# Altium schematic sheet DS_zk.SchDoc
size A3
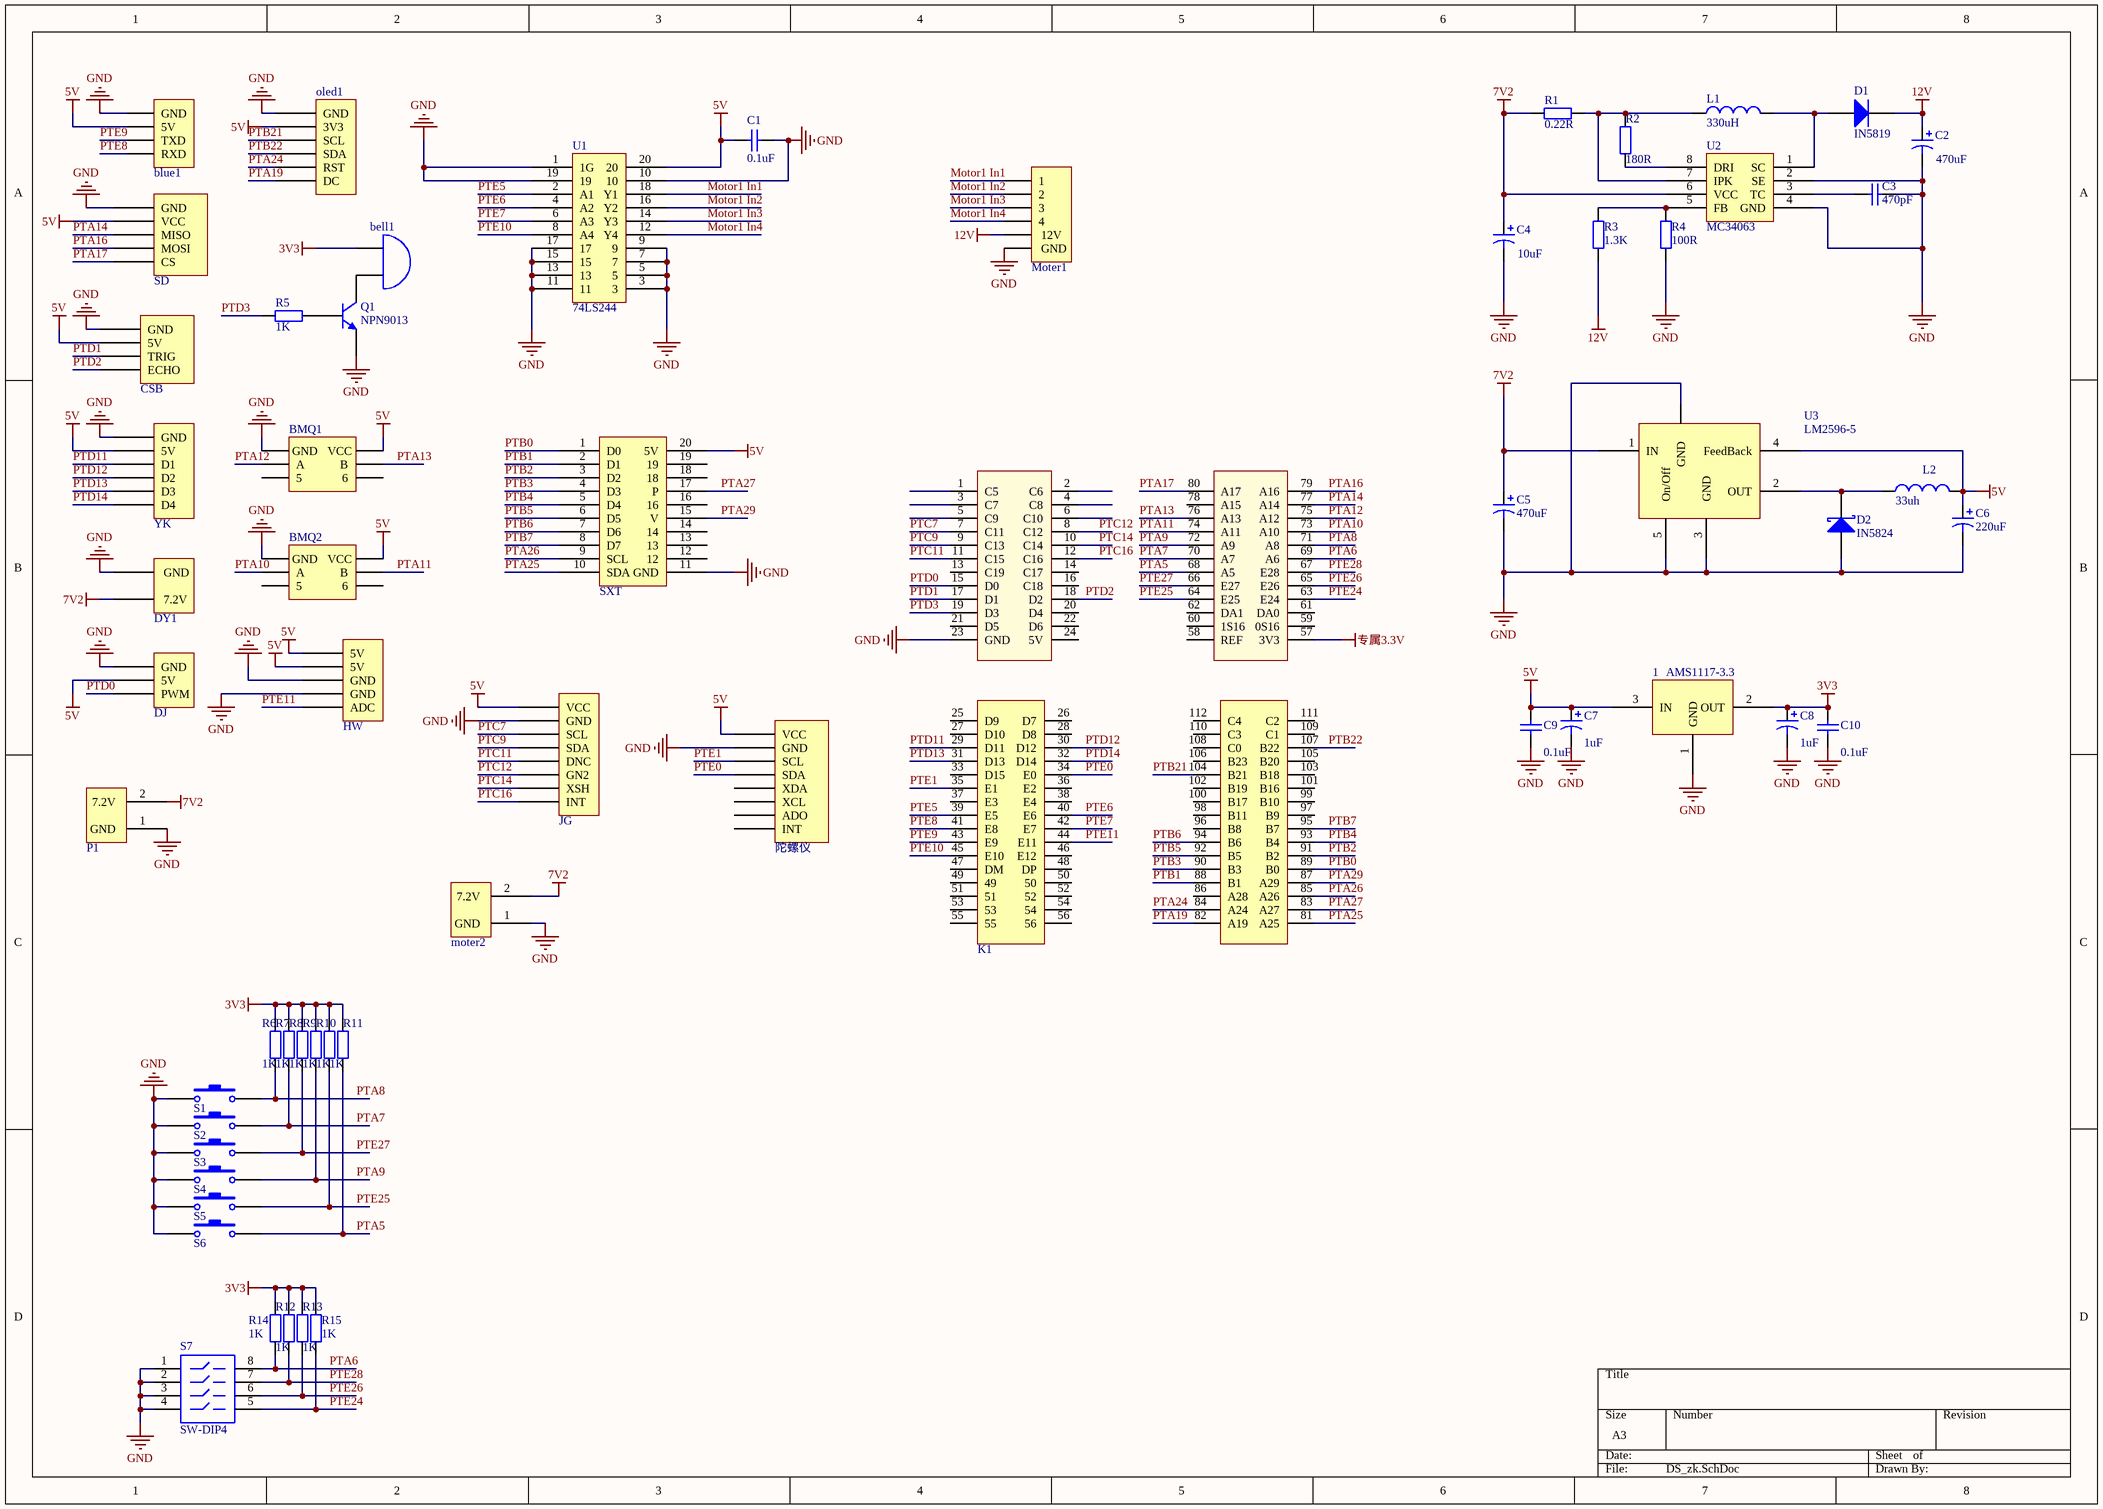
[diagram p0: DS_zk.SchDoc]

## Parts
1  AMS1117-3.3  [lm1117-5v]
*1  SD  [HDR1X5 - duplicate]
*2  CSB  [HDR1X4]
*3  YK  [HDR1X6]
*4  SXT  [摄像头]
*5  HW  [HDR1X5]
*6  DJ  [HDR1X3]
*7  JG  [HDR1X8]
*8  陀螺仪  [HDR1X8]
bell1  Bell  [bezzer]  (value not drawn)
blue1  blueteeth2  [HDR1X4]  (value not drawn)
BMQ1  encode_1  [HDR2X3]  (value not drawn)
BMQ2  encode_2  [HDR2X3]  (value not drawn)
C1  0.1uF  [0603]
C2  470uF  [470UF]
C3  470pF  [0805]
C4  10uF  [0805]
C5  value 470uF  [470uf]  (hidden comment: Cap Pol1)
C6  value 220uF  [220uf]  (hidden comment: Cap Pol1)
C7  value 1uF  [0805]  (hidden comment: Cap Pol1)
C8  value 1uF  [0805]  (hidden comment: Cap Pol1)
C9  value 0.1uF  [0805]  (hidden comment: Cap)
C10  value 0.1uF  [0805]  (hidden comment: Cap)
D1  IN5819  [0805LED]
D2  IN5824  [1N5824]
DY1  H1  [HDR1X2]  (value not drawn)
K1  K60  [DS_K60]  (value not drawn)
L1  330uH  [电感8*8]
L2  value 33uh  [电感8*8]  (hidden comment: Inductor)
Moter1  Motor  [HDR1X6]  (value not drawn)
moter2  H1  [KF301-2P]  (value not drawn)
oled1  OLED  [HDR1X6]  (value not drawn)
P1  H1  [KF301-2P]  (value not drawn)
Q1  NPN9013  [npn9013]
R1  0.22R  [0805]
R2  180R  [0805]
R3  1.3K  [0805]
R4  100R  [0805]
R5  value 1K  [0805]  (hidden comment: Res2)
R6  value 1K  [0805]  (hidden comment: Res2)
R7  value 1K  [0805]  (hidden comment: Res2)
R8  value 1K  [0805]  (hidden comment: Res2)
R9  value 1K  [0805]  (hidden comment: Res2)
R10  value 1K  [0805]  (hidden comment: Res2)
R11  value 1K  [0805]  (hidden comment: Res2)
R12  value 1K  [0805]  (hidden comment: Res2)
R13  value 1K  [0805]  (hidden comment: Res2)
R14  value 1K  [0805]  (hidden comment: Res2)
R15  value 1K  [0805]  (hidden comment: Res2)
S1  SW-PB  [BUTTON]  (value not drawn)
S2  SW-PB  [BUTTON]  (value not drawn)
S3  SW-PB  [BUTTON]  (value not drawn)
S4  SW-PB  [BUTTON]  (value not drawn)
S5  SW-PB  [BUTTON]  (value not drawn)
S6  SW-PB  [BUTTON]  (value not drawn)
S7  SW-DIP4  [BMKG]
U1  74LS244  [74ls244DA]
U2  MC34063  [MC34063]
U3  LM2596-5  [LM2596]

## Nets
3V3: 1.2(OUT) bell1.1(A) C8.1 C10.2 R6.2 R7.2 R8.2 R9.2 R10.2 R11.2 R12.2 R13.2 R14.2 R15.2
5V: 1.3(IN) *1.2(VCC) *2.2(5V) *3.2(5V) *4.20(5V) *5.1(5V) *5.2(5V) *6.2(5V) *7.1(VCC) *8.1(VCC) blue1.2(5V) BMQ1.2(VCC) BMQ2.2(VCC) C1.2 C6.1 C7.1 C9.2 L2.2 oled1.2(3V3) U1.20 U3.4(FeedBack)
7V2: C4.1 C5.1 DY1.2(7.2V) moter2.2(7.2V) P1.2(7.2V) R1.2 U2.6(VCC) U3.1(IN)
12V: C2.1 D1.2(K) Moter1.5(12V) R3.2
GND: 1.1(GND) *1.1(GND) *2.1(GND) *3.1(GND) *4.11(GND) *5.3(GND) *5.4(GND) *6.1(GND) *7.2(GND) *8.2(GND) blue1.1(GND) BMQ1.1(GND) BMQ2.1(GND) C1.1 C2.2 C3.2 C4.2 C5.2 C6.2 C7.2 C8.2 C9.1 C10.1 D2.2(K) DY1.1(GND) K1.23(GND) Moter1.6(GND) moter2.1(GND) oled1.1(GND) P1.1(GND) Q1.1(E) R4.2 S1.1 S2.1 S3.1 S4.1 S5.1 S6.1 S7.1 S7.2 S7.3 S7.4 U1.1(1G) U1.3 U1.5 U1.7 U1.9 U1.10 U1.11 U1.13 U1.15 U1.17 U1.19 U2.2(SE) U2.4(GND) U3.3(GND) U3.5(On/Off) U3.6(GND)
专属3.3V: K1.57(3V3)
Motor1 In1: Moter1.1 U1.18(Y1)
Motor1 In2: Moter1.2 U1.16(Y2)
Motor1 In3: Moter1.3 U1.14(Y3)
Motor1 In4: Moter1.4 U1.12(Y4)
PTA5: K1.68(A5) R11.1 S6.2
PTA6: K1.69(A6) R14.1 S7.8
PTA7: K1.70(A7) R7.1 S2.2
PTA8: K1.71(A8) R6.1 S1.2
PTA9: K1.72(A9) R9.1 S4.2
PTA10: BMQ2.3(A) K1.73(A10)
PTA11: BMQ2.4(B) K1.74(A11)
PTA12: BMQ1.3(A) K1.75(A12)
PTA13: BMQ1.4(B) K1.76(A13)
PTA14: *1.3(MISO) K1.77(A14)
PTA16: *1.4(MOSI) K1.79(A16)
PTA17: *1.5(CS) K1.80(A17)
PTA19: K1.82(A19) oled1.6(DC)
PTA24: K1.84(A24) oled1.5(RST)
PTA25: *4.10(SDA) K1.81(A25)
PTA26: *4.9(SCL) K1.85(A26)
PTA27: *4.17(P) K1.83(A27)
PTA29: *4.15(V) K1.87(A29)
PTB0: *4.1(D0) K1.89(B0)
PTB1: *4.2(D1) K1.88(B1)
PTB2: *4.3(D2) K1.91(B2)
PTB3: *4.4(D3) K1.90(B3)
PTB4: *4.5(D4) K1.93(B4)
PTB5: *4.6(D5) K1.92(B5)
PTB6: *4.7(D6) K1.94(B6)
PTB7: *4.8(D7) K1.95(B7)
PTB21: K1.104(B21) oled1.3(SCL)
PTB22: K1.107(B22) oled1.4(SDA)
PTC7: *7.3(SCL) K1.7(C11)
PTC9: *7.4(SDA) K1.9(C13)
PTC11: *7.5(DNC) K1.11(C15)
PTC12: *7.6(GN2) K1.8(C12)
PTC14: *7.7(XSH) K1.10(C14)
PTC16: *7.8(INT) K1.12(C16)
PTD0: *6.3(PWM) K1.15(D0)
PTD1: *2.3(TRIG) K1.17(D1)
PTD2: *2.4(ECHO) K1.18(D2)
PTD3: K1.19(D3) R5.1
PTD11: *3.3(D1) K1.29(D11)
PTD12: *3.4(D2) K1.30(D12)
PTD13: *3.5(D3) K1.31(D13)
PTD14: *3.6(D4) K1.32(D14)
PTE0: *8.4(SDA) K1.34(E0)
PTE1: *8.3(SCL) K1.35(E1)
PTE5: K1.39(E5) U1.2(A1)
PTE6: K1.40(E6) U1.4(A2)
PTE7: K1.42(E7) U1.6(A3)
PTE8: blue1.4(RXD) K1.41(E8)
PTE9: blue1.3(TXD) K1.43(E9)
PTE10: K1.45(E10) U1.8(A4)
PTE11: *5.5(ADC) K1.44(E11)
PTE24: K1.63(E24) R15.1 S7.5
PTE25: K1.64(E25) R10.1 S5.2
PTE26: K1.65(E26) R13.1 S7.6
PTE27: K1.66(E27) R8.1 S3.2
PTE28: K1.67(E28) R12.1 S7.7
Netbell1_2: bell1.2(B) Q1.3(C)
NetC3_1: C3.1 U2.3(TC)
NetD1_1: D1.1(A) L1.2 U2.1(SC)
NetD2_1: D2.1(A) L2.1 U3.2(OUT)
NetL1_1: L1.1 R1.1 R2.2 U2.7(IPK)
NetQ1_2: Q1.2(B) R5.2
NetR2_1: R2.1 U2.8(DRI)
NetR3_1: R3.1 R4.1 U2.5(FB)

Not connected (* = marked no-connect by the designer): *4 12 13 14 16 18 19; *8 5(XDA) 6(XCL) 7(ADO) 8(INT); BMQ1 5 6; BMQ2 5 6; K1 1(C5) 2(C6) 3(C7) 4(C8) 5(C9) 6(C10) 13(C19) 14(C17) 16(C18) 20(D4) 21(D5) 22(D6) 24(5V) 25(D9) 26(D7) 27(D10) 28(D8) 33(D15) 36(E2) 37(E3) 38(E4) 46(E12) 47(DM) 48(DP) 49 50 51 52 53 54 55 56 58(REF) 59(0S16) 60(1S16) 61(DA0) 62(DA1) 78(A15) 86(A28) 96(B8) 97(B9) 98(B11) 99(B10) 100(B17) 101(B16) 102(B19) 103(B18) 105(B20) 106(B23) 108(C0) 109(C1) 110(C3) 111(C2) 112(C4)

## Library data of the parts
1 = LT1117-3.3
*1 = SD卡
*2 = 超声波
*3 = 遥控
*4 = 摄像头
*5 = 红外测距
*6 = 舵机
*7 = 激光
bell1 = Bell: Electrical Bell; Published: 24-Mar-1999; LatestRevisionDate: 17-Jul-2002; LatestRevisionNote: Re-released for DXP Platform.; PackageReference: PIN2; Publisher: Altium Limited
blue1 = blueteeth
BMQ1 BMQ2 = encode
C1 C3 = Cap Semi: Capacitor (Semiconductor SIM Model); Published: 8-Jun-2000; LatestRevisionDate: 29-May-2009; LatestRevisionNote: IPC-7351 Footprint Added.; PackageReference: C1206; Publisher: Altium Limited; PackageDescription: Chip Capacitor
  C1: Value: 0.1uF
  C3: Value: 470pF
C2 C4 = Cap Pol3: Polarized Capacitor (Surface Mount); Published: 8-Jun-2000; LatestRevisionDate: 29-May-2009; LatestRevisionNote: IPC-7351 Footprint Added.; PackageReference: C0805; Publisher: Altium Limited; PackageDescription: Chip Capacitor
  C2: Value: 470uF
  C4: Value: 10uF
C5-C8 = Cap Pol1: Polarized Capacitor (Radial); Published: 8-Jun-2000; LatestRevisionDate: 17-Jul-2002; LatestRevisionNote: Re-released for DXP Platform.; PackageReference: RB7.6-15; Publisher: Altium Limited; PackageDescription: Polarized Capacitor (Radial); 2 Leads
C9 C10 = Cap: Capacitor; Published: 8-Jun-2000; LatestRevisionDate: 17-Jul-2002; LatestRevisionNote: Re-released for DXP Platform.; PackageReference: RAD-0.3; Publisher: Altium Limited; PackageDescription: Radial Cap, Thru-Hole; 2 Leads; 0.3 in Pin Spacing
D1 = Diode: Default Diode; Published: 8-Jun-2000; LatestRevisionDate: 17-Jul-2002; LatestRevisionNote: Re-released for DXP Platform.; PackageVersion: Sep-1996; PackageReference: SMC; Publisher: Altium Limited; PackageDescription: DO-214-AB/SMC; 2 C-Bend Leads; Body 7.9 x 5.9 mm, inc. leads (LxW); Code_JEDEC: DO-214-AB
L1 L2 = Inductor: Code_IEC: 1005; Published: 8-Jun-2000; LatestRevisionDate: 29-May-2009; LatestRevisionNote: IPC-7351 Footprint Added.; PackageReference: 0402-A; Publisher: Altium Limited; PackageDescription: Chip Inductor; Code_JEITA: 0402
  L1: Value: 330uH
Q1 = 2N3904: NPN General Purpose Amplifier; Published: 8-Jun-2000; LatestRevisionDate: 15-Jan-2003; LatestRevisionNote: PCB Footprint 'BCY-W3/D4.7' replaced; DatasheetVersion: 1997; PackageVersion: Sep-1998; PackageReference: TO-92A; Publisher: Altium Limited; PackageDescription: TO, Flat Index; 3 In-Line, Axial Leads; Body Dia. 4.5mm; Leads 0.51 x 0.48 mm (max); ComponentLink1Description: Manufacturer Link; ComponentLink1URL: http://www.fairchildsemi.com/; ComponentLink2Description: Datasheet; ComponentLink2URL: http://www.fairchildsemi.com/ds/2N%2F2N3904.pdf
R1-R15 = Res2: Resistor; Published: 8-Jun-2000; LatestRevisionDate: 17-Jul-2002; LatestRevisionNote: Re-released for DXP Platform.; PackageReference: AXIAL-0.4; Publisher: Altium Limited; PackageDescription: Axial Device, Thru-Hole; 2 Leads; 0.4 in Pin Spacing
  R1: Value: 0.22R
  R2: Value: 180R
  R3: Value: 1.3K
  R4: Value: 100R
S1-S6 = SW-PB: Switch; Published: 24-Mar-1999; LatestRevisionDate: 17-Jul-2002; LatestRevisionNote: Re-released for DXP Platform.; PackageReference: SPST-2; Publisher: Altium Limited; PackageDescription: Switch; 2 Leads
S7 = SW-DIP4: DIP Switch; Published: 24-Mar-1999; LatestRevisionDate: 17-Jul-2002; LatestRevisionNote: Re-released for DXP Platform.; PackageReference: DIP-8; Publisher: Altium Limited
U3 = LM2596